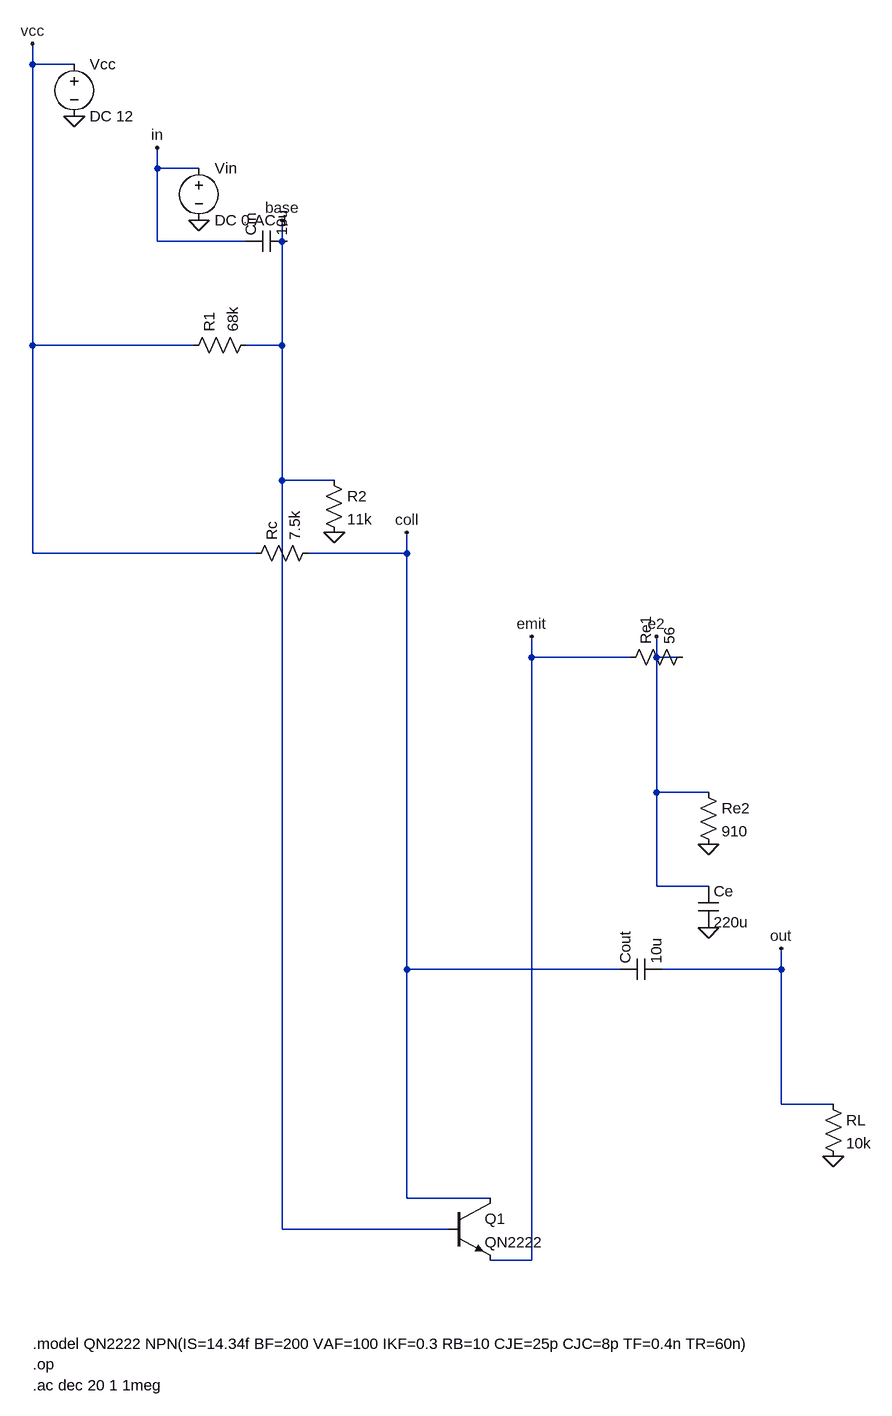
[diagram p0: schematic ce_bjt_amp_generated.asc]
ce_bjt_amp_generated.asc, the LTspice schematic file:
Version 4
SHEET 1 1562 2320
WIRE 288 128 224 128
WIRE 480 288 416 288
WIRE 552 400 416 400
WIRE 616 400 608 400
WIRE 472 560 224 560
WIRE 552 560 608 560
WIRE 688 768 608 768
WIRE 568 880 224 880
WIRE 648 880 800 880
WIRE 1144 1040 992 1040
WIRE 1224 1040 1184 1040
WIRE 1264 1248 1184 1248
WIRE 1264 1392 1184 1392
WIRE 1128 1520 800 1520
WIRE 1192 1520 1376 1520
WIRE 1456 1728 1376 1728
WIRE 928 1872 800 1872
WIRE 864 1920 608 1920
WIRE 928 1968 992 1968
WIRE 224 96 224 880
WIRE 416 256 416 400
WIRE 608 368 608 1920
WIRE 800 848 800 1872
WIRE 992 1008 992 1968
WIRE 1184 1008 1184 1392
WIRE 1376 1488 1376 1728
FLAG 288 208 0
FLAG 480 368 0
FLAG 688 848 0
FLAG 1264 1328 0
FLAG 1264 1456 0
FLAG 1456 1808 0
FLAG 224 96 vcc
FLAG 416 256 in
FLAG 608 368 base
FLAG 800 848 coll
FLAG 992 1008 emit
FLAG 1184 1008 e2
FLAG 1376 1488 out
SYMBOL voltage 288 112 R0
SYMATTR InstName Vcc
SYMATTR Value DC 12
SYMBOL voltage 480 272 R0
SYMATTR InstName Vin
SYMATTR Value DC 0 AC 1
SYMBOL cap 552 416 R270
SYMATTR InstName Cin
SYMATTR Value 10u
SYMBOL res 456 576 R270
SYMATTR InstName R1
SYMATTR Value 68k
SYMBOL res 672 752 R0
SYMATTR InstName R2
SYMATTR Value 11k
SYMBOL res 552 896 R270
SYMATTR InstName Rc
SYMATTR Value 7.5k
SYMBOL res 1128 1056 R270
SYMATTR InstName Re1
SYMATTR Value 56
SYMBOL res 1248 1232 R0
SYMATTR InstName Re2
SYMATTR Value 910
SYMBOL cap 1248 1392 R0
SYMATTR InstName Ce
SYMATTR Value 220u
SYMBOL cap 1128 1536 R270
SYMATTR InstName Cout
SYMATTR Value 10u
SYMBOL res 1440 1712 R0
SYMATTR InstName RL
SYMATTR Value 10k
SYMBOL npn 864 1872 R0
SYMATTR InstName Q1
SYMATTR Value QN2222
TEXT 224 2096 Left 2 !.model QN2222 NPN(IS=14.34f BF=200 VAF=100 IKF=0.3 RB=10 CJE=25p CJC=8p TF=0.4n TR=60n)
TEXT 224 2128 Left 2 !.op
TEXT 224 2160 Left 2 !.ac dec 20 1 1meg

The netlist it stands for:
* ce_bjt_amp_generated.asc
Vcc vcc 0 DC 12
Vin in 0 DC 0 AC 1
Cin in base 10u
R1 vcc base 68k
R2 base 0 11k
Rc vcc coll 7.5k
Re1 emit e2 56
Re2 e2 0 910
Ce e2 0 220u
Cout coll out 10u
RL out 0 10k
Q1 coll base emit 0 QN2222
.model NPN NPN
.model PNP PNP
.lib standard.bjt
.model QN2222 NPN(IS=14.34f BF=200 VAF=100 IKF=0.3 RB=10 CJE=25p CJC=8p TF=0.4n TR=60n)
.op
.ac dec 20 1 1meg
.backanno
.end